# EAGLE design PGTN029_sequential_switch (EAGLE 9.6.0)
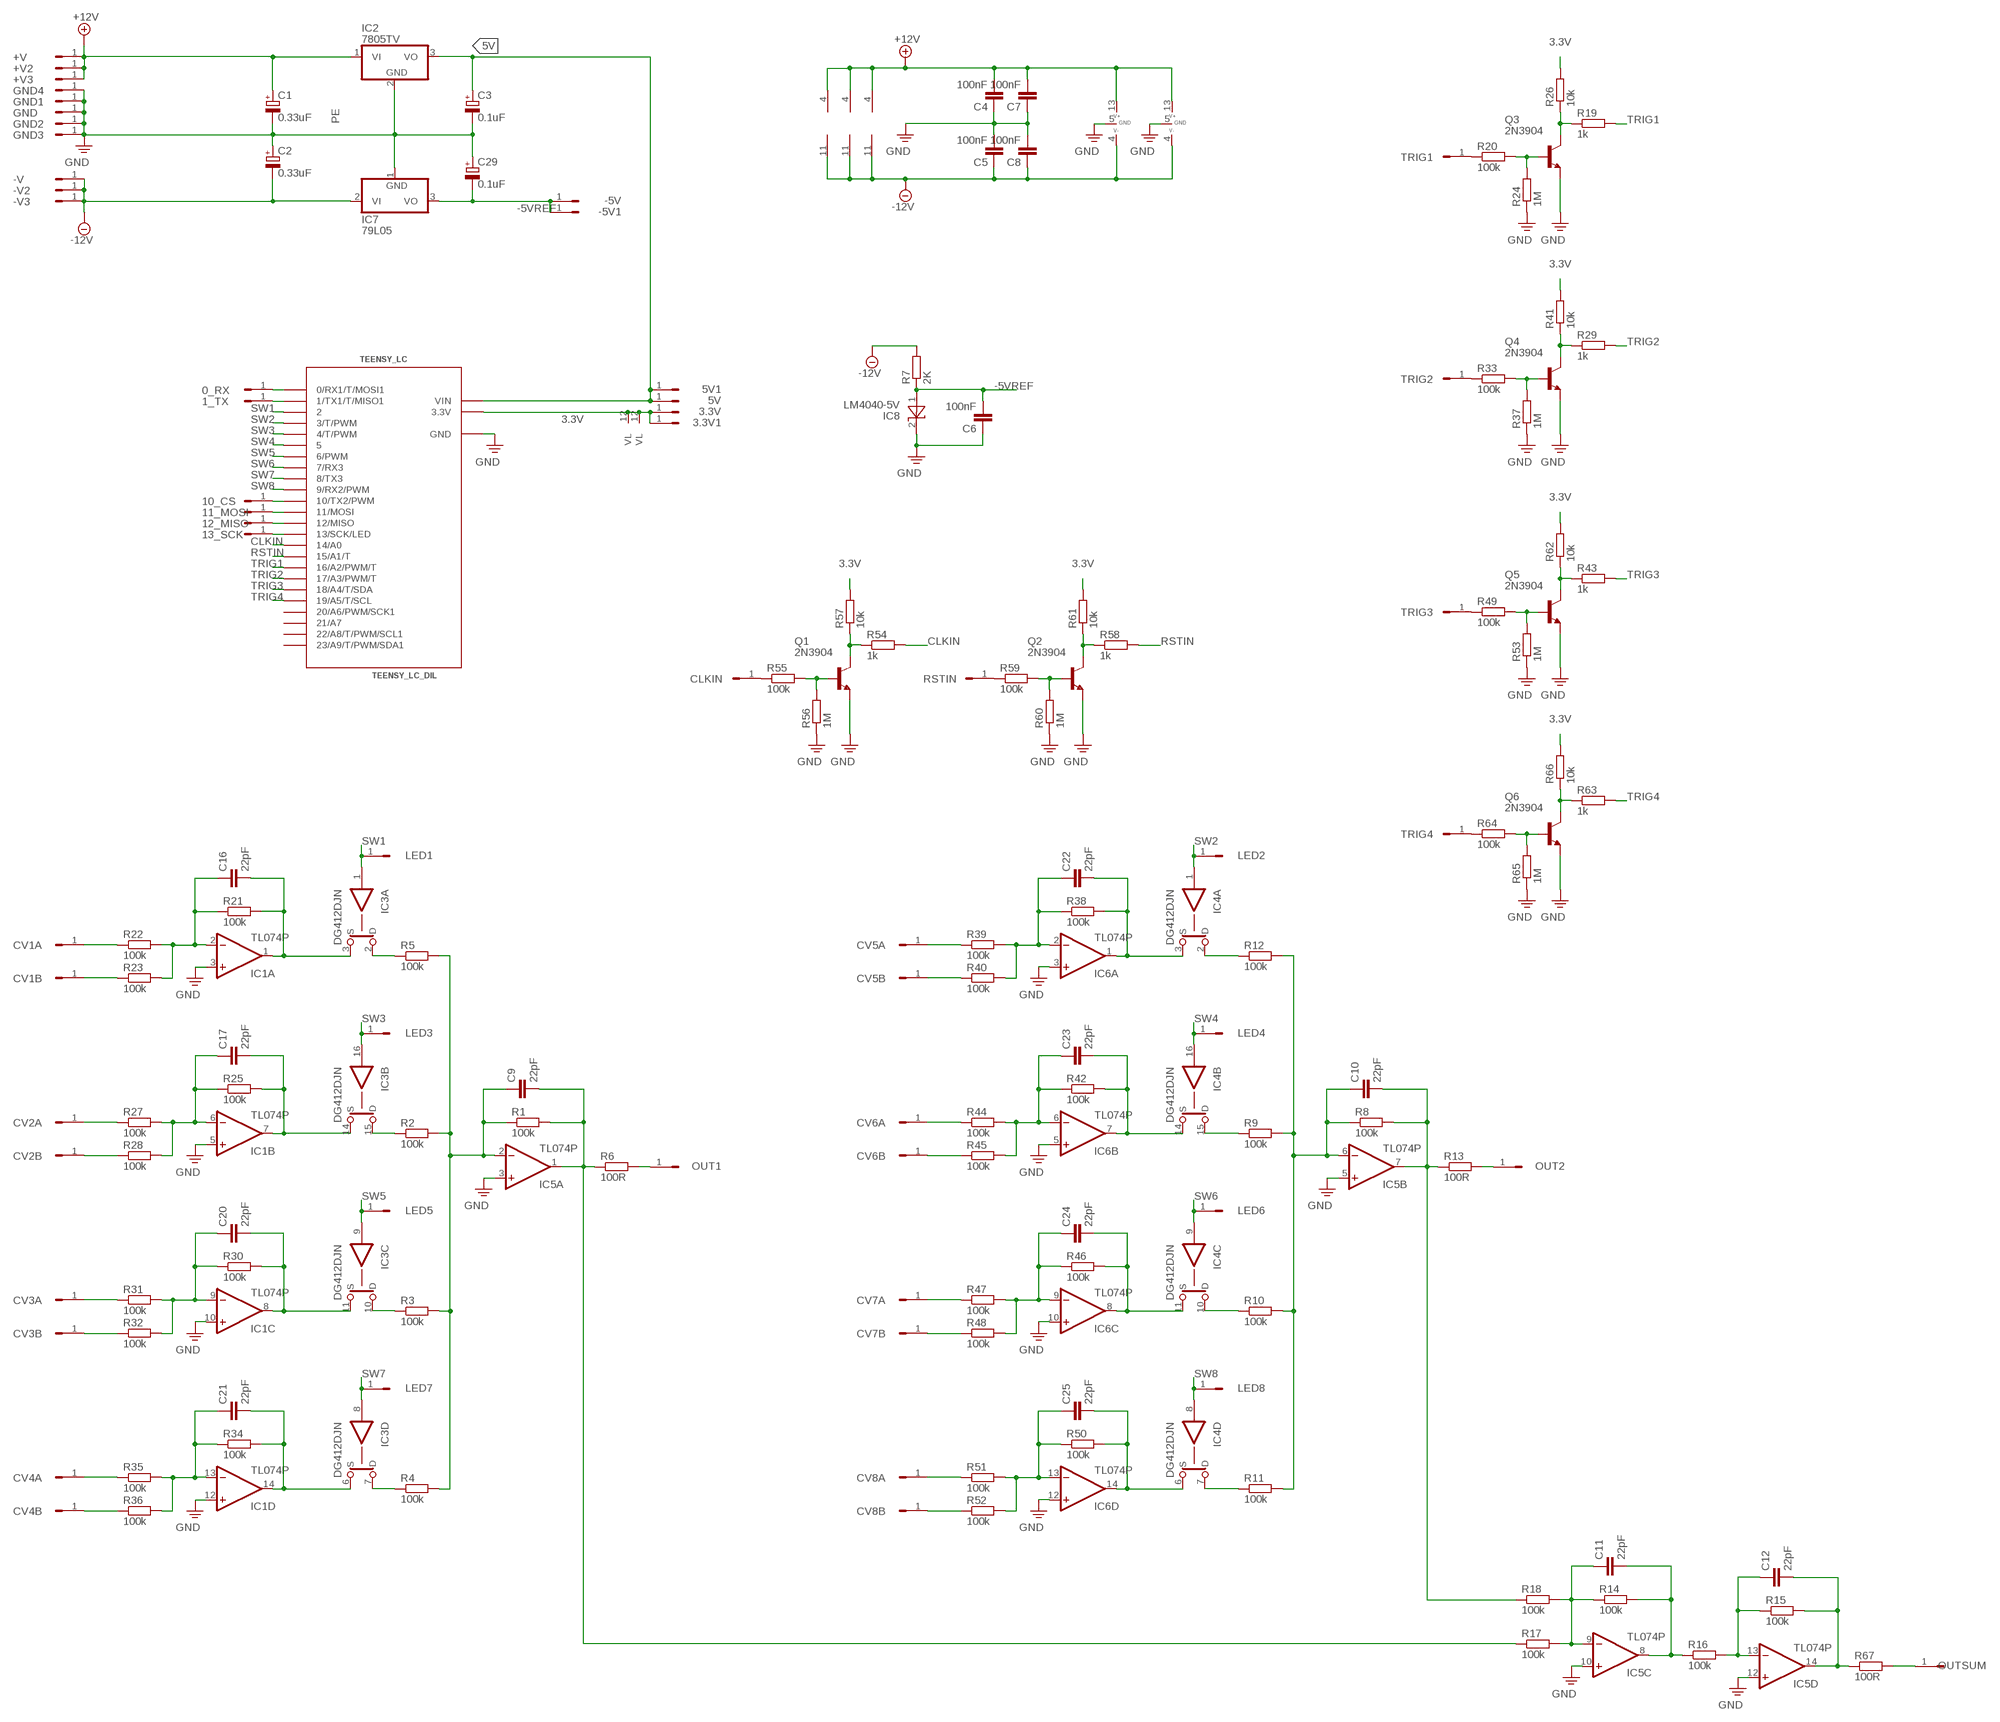
[diagram p0: schematic, sheet 1]

## Parts
0_RX  HEADER/MALE/01  [HEADER/MALE/01]
1_TX  HEADER/MALE/01  [HEADER/MALE/01]
3.3V  HEADER/MALE/01  [HEADER/MALE/01]
3.3V1  HEADER/MALE/01  [HEADER/MALE/01]
5V  HEADER/MALE/01  [HEADER/MALE/01]
5V1  HEADER/MALE/01  [HEADER/MALE/01]
10_CS  HEADER/MALE/01  [HEADER/MALE/01]
11_MOSI  HEADER/MALE/01  [HEADER/MALE/01]
12_MISO  HEADER/MALE/01  [HEADER/MALE/01]
13_SCK  HEADER/MALE/01  [HEADER/MALE/01]
+V  HEADER/MALE/01  [HEADER/MALE/01]
+V2  HEADER/MALE/01  [HEADER/MALE/01]
+V3  HEADER/MALE/01  [HEADER/MALE/01]
-5V  HEADER/MALE/01  [HEADER/MALE/01]
-5V1  HEADER/MALE/01  [HEADER/MALE/01]
-V  HEADER/MALE/01  [HEADER/MALE/01]
-V2  HEADER/MALE/01  [HEADER/MALE/01]
-V3  HEADER/MALE/01  [HEADER/MALE/01]
C1  0.33uF  CAPACITOR/POLARIZEDE2.5-6  [E2,5-6]
C2  0.33uF  CAPACITOR/POLARIZEDE2.5-6  [E2,5-6]
C3  0.1uF  CAPACITOR/POLARIZEDE2.5-6  [E2,5-6]
C4  100nF  CAPACITORCERAMICDISC/5  [CERAMICDISC/5]
C5  100nF  CAPACITORCERAMICDISC/5  [CERAMICDISC/5]
C6  100nF  CAPACITORCERAMICDISC/5  [CERAMICDISC/5]
C7  100nF  CAPACITORCERAMICDISC/5  [CERAMICDISC/5]
C8  100nF  CAPACITORCERAMICDISC/5  [CERAMICDISC/5]
C9  22pF  CAPACITORCERAMICDISC/5  [CERAMICDISC/5]
C10  22pF  CAPACITORCERAMICDISC/5  [CERAMICDISC/5]
C11  22pF  CAPACITORCERAMICDISC/5  [CERAMICDISC/5]
C12  22pF  CAPACITORCERAMICDISC/5  [CERAMICDISC/5]
C16  22pF  CAPACITORCERAMICDISC/5  [CERAMICDISC/5]
C17  22pF  CAPACITORCERAMICDISC/5  [CERAMICDISC/5]
C20  22pF  CAPACITORCERAMICDISC/5  [CERAMICDISC/5]
C21  22pF  CAPACITORCERAMICDISC/5  [CERAMICDISC/5]
C22  22pF  CAPACITORCERAMICDISC/5  [CERAMICDISC/5]
C23  22pF  CAPACITORCERAMICDISC/5  [CERAMICDISC/5]
C24  22pF  CAPACITORCERAMICDISC/5  [CERAMICDISC/5]
C25  22pF  CAPACITORCERAMICDISC/5  [CERAMICDISC/5]
C29  0.1uF  CAPACITOR/POLARIZEDE2.5-6  [E2,5-6]
CLKIN  HEADER/MALE/01  [HEADER/MALE/01]
CV1A  HEADER/MALE/01  [HEADER/MALE/01]
CV1B  HEADER/MALE/01  [HEADER/MALE/01]
CV2A  HEADER/MALE/01  [HEADER/MALE/01]
CV2B  HEADER/MALE/01  [HEADER/MALE/01]
CV3A  HEADER/MALE/01  [HEADER/MALE/01]
CV3B  HEADER/MALE/01  [HEADER/MALE/01]
CV4A  HEADER/MALE/01  [HEADER/MALE/01]
CV4B  HEADER/MALE/01  [HEADER/MALE/01]
CV5A  HEADER/MALE/01  [HEADER/MALE/01]
CV5B  HEADER/MALE/01  [HEADER/MALE/01]
CV6A  HEADER/MALE/01  [HEADER/MALE/01]
CV6B  HEADER/MALE/01  [HEADER/MALE/01]
CV7A  HEADER/MALE/01  [HEADER/MALE/01]
CV7B  HEADER/MALE/01  [HEADER/MALE/01]
CV8A  HEADER/MALE/01  [HEADER/MALE/01]
CV8B  HEADER/MALE/01  [HEADER/MALE/01]
GND  HEADER/MALE/01  [HEADER/MALE/01]
GND1  HEADER/MALE/01  [HEADER/MALE/01]
GND2  HEADER/MALE/01  [HEADER/MALE/01]
GND3  HEADER/MALE/01  [HEADER/MALE/01]
GND4  HEADER/MALE/01  [HEADER/MALE/01]
IC1  TL074P  [DIL14]
IC2  7805TV  [TO220V]
IC3  DG412DJN  [DIL16]
IC4  DG412DJN  [DIL16]
IC5  TL074P  [DIL14]
IC6  TL074P  [DIL14]
IC7  79L05  79L05Z  [TO92]
IC8  LM4040-5V  LM4040  [TO92]
LED1  HEADER/MALE/01  [HEADER/MALE/01]
LED2  HEADER/MALE/01  [HEADER/MALE/01]
LED3  HEADER/MALE/01  [HEADER/MALE/01]
LED4  HEADER/MALE/01  [HEADER/MALE/01]
LED5  HEADER/MALE/01  [HEADER/MALE/01]
LED6  HEADER/MALE/01  [HEADER/MALE/01]
LED7  HEADER/MALE/01  [HEADER/MALE/01]
LED8  HEADER/MALE/01  [HEADER/MALE/01]
OUT1  HEADER/MALE/01  [HEADER/MALE/01]
OUT2  HEADER/MALE/01  [HEADER/MALE/01]
OUTSUM  HEADER/MALE/01  [HEADER/MALE/01]
Q1  2N3904  [TO92]
Q2  2N3904  [TO92]
Q3  2N3904  [TO92]
Q4  2N3904  [TO92]
Q5  2N3904  [TO92]
Q6  2N3904  [TO92]
R1  100k  RESISTORRESISTOR/UPRIGHT/7.5  [RESISTOR/7.5]
R2  100k  RESISTORRESISTOR/UPRIGHT/7.5  [RESISTOR/7.5]
R3  100k  RESISTORRESISTOR/UPRIGHT/7.5  [RESISTOR/7.5]
R4  100k  RESISTORRESISTOR/UPRIGHT/7.5  [RESISTOR/7.5]
R5  100k  RESISTORRESISTOR/UPRIGHT/7.5  [RESISTOR/7.5]
R6  100R  RESISTORRESISTOR/UPRIGHT/7.5  [RESISTOR/7.5]
R7  2K  RESISTORRESISTOR/UPRIGHT/7.5  [RESISTOR/7.5]
R8  100k  RESISTORRESISTOR/UPRIGHT/7.5  [RESISTOR/7.5]
R9  100k  RESISTORRESISTOR/UPRIGHT/7.5  [RESISTOR/7.5]
R10  100k  RESISTORRESISTOR/UPRIGHT/7.5  [RESISTOR/7.5]
R11  100k  RESISTORRESISTOR/UPRIGHT/7.5  [RESISTOR/7.5]
R12  100k  RESISTORRESISTOR/UPRIGHT/7.5  [RESISTOR/7.5]
R13  100R  RESISTORRESISTOR/UPRIGHT/7.5  [RESISTOR/7.5]
R14  100k  RESISTORRESISTOR/UPRIGHT/7.5  [RESISTOR/7.5]
R15  100k  RESISTORRESISTOR/UPRIGHT/7.5  [RESISTOR/7.5]
R16  100k  RESISTORRESISTOR/UPRIGHT/7.5  [RESISTOR/7.5]
R17  100k  RESISTORRESISTOR/UPRIGHT/7.5  [RESISTOR/7.5]
R18  100k  RESISTORRESISTOR/UPRIGHT/7.5  [RESISTOR/7.5]
R19  1k  RESISTORRESISTOR/UPRIGHT/7.5  [RESISTOR/7.5]
R20  100k  RESISTORRESISTOR/UPRIGHT/7.5  [RESISTOR/7.5]
R21  100k  RESISTORRESISTOR/UPRIGHT/7.5  [RESISTOR/7.5]
R22  100k  RESISTORRESISTOR/UPRIGHT/7.5  [RESISTOR/7.5]
R23  100k  RESISTORRESISTOR/UPRIGHT/7.5  [RESISTOR/7.5]
R24  1M  RESISTORRESISTOR/UPRIGHT/7.5  [RESISTOR/7.5]
R25  100k  RESISTORRESISTOR/UPRIGHT/7.5  [RESISTOR/7.5]
R26  10k  RESISTORRESISTOR/UPRIGHT/7.5  [RESISTOR/7.5]
R27  100k  RESISTORRESISTOR/UPRIGHT/7.5  [RESISTOR/7.5]
R28  100k  RESISTORRESISTOR/UPRIGHT/7.5  [RESISTOR/7.5]
R29  1k  RESISTORRESISTOR/UPRIGHT/7.5  [RESISTOR/7.5]
R30  100k  RESISTORRESISTOR/UPRIGHT/7.5  [RESISTOR/7.5]
R31  100k  RESISTORRESISTOR/UPRIGHT/7.5  [RESISTOR/7.5]
R32  100k  RESISTORRESISTOR/UPRIGHT/7.5  [RESISTOR/7.5]
R33  100k  RESISTORRESISTOR/UPRIGHT/7.5  [RESISTOR/7.5]
R34  100k  RESISTORRESISTOR/UPRIGHT/7.5  [RESISTOR/7.5]
R35  100k  RESISTORRESISTOR/UPRIGHT/7.5  [RESISTOR/7.5]
R36  100k  RESISTORRESISTOR/UPRIGHT/7.5  [RESISTOR/7.5]
R37  1M  RESISTORRESISTOR/UPRIGHT/7.5  [RESISTOR/7.5]
R38  100k  RESISTORRESISTOR/UPRIGHT/7.5  [RESISTOR/7.5]
R39  100k  RESISTORRESISTOR/UPRIGHT/7.5  [RESISTOR/7.5]
R40  100k  RESISTORRESISTOR/UPRIGHT/7.5  [RESISTOR/7.5]
R41  10k  RESISTORRESISTOR/UPRIGHT/7.5  [RESISTOR/7.5]
R42  100k  RESISTORRESISTOR/UPRIGHT/7.5  [RESISTOR/7.5]
R43  1k  RESISTORRESISTOR/UPRIGHT/7.5  [RESISTOR/7.5]
R44  100k  RESISTORRESISTOR/UPRIGHT/7.5  [RESISTOR/7.5]
R45  100k  RESISTORRESISTOR/UPRIGHT/7.5  [RESISTOR/7.5]
R46  100k  RESISTORRESISTOR/UPRIGHT/7.5  [RESISTOR/7.5]
R47  100k  RESISTORRESISTOR/UPRIGHT/7.5  [RESISTOR/7.5]
R48  100k  RESISTORRESISTOR/UPRIGHT/7.5  [RESISTOR/7.5]
R49  100k  RESISTORRESISTOR/UPRIGHT/7.5  [RESISTOR/7.5]
R50  100k  RESISTORRESISTOR/UPRIGHT/7.5  [RESISTOR/7.5]
R51  100k  RESISTORRESISTOR/UPRIGHT/7.5  [RESISTOR/7.5]
R52  100k  RESISTORRESISTOR/UPRIGHT/7.5  [RESISTOR/7.5]
R53  1M  RESISTORRESISTOR/UPRIGHT/7.5  [RESISTOR/7.5]
R54  1k  RESISTORRESISTOR/UPRIGHT/7.5  [RESISTOR/7.5]
R55  100k  RESISTORRESISTOR/UPRIGHT/7.5  [RESISTOR/7.5]
R56  1M  RESISTORRESISTOR/UPRIGHT/7.5  [RESISTOR/7.5]
R57  10k  RESISTORRESISTOR/UPRIGHT/7.5  [RESISTOR/7.5]
R58  1k  RESISTORRESISTOR/UPRIGHT/7.5  [RESISTOR/7.5]
R59  100k  RESISTORRESISTOR/UPRIGHT/7.5  [RESISTOR/7.5]
R60  1M  RESISTORRESISTOR/UPRIGHT/7.5  [RESISTOR/7.5]
R61  10k  RESISTORRESISTOR/UPRIGHT/7.5  [RESISTOR/7.5]
R62  10k  RESISTORRESISTOR/UPRIGHT/7.5  [RESISTOR/7.5]
R63  1k  RESISTORRESISTOR/UPRIGHT/7.5  [RESISTOR/7.5]
R64  100k  RESISTORRESISTOR/UPRIGHT/7.5  [RESISTOR/7.5]
R65  1M  RESISTORRESISTOR/UPRIGHT/7.5  [RESISTOR/7.5]
R66  10k  RESISTORRESISTOR/UPRIGHT/7.5  [RESISTOR/7.5]
R67  100R  RESISTORRESISTOR/UPRIGHT/7.5  [RESISTOR/7.5]
RSTIN  HEADER/MALE/01  [HEADER/MALE/01]
TEENSY_LC  TEENSY_LC_DIL  [TEENSY_3.0-3.2&LC_DIL]
TRIG1  HEADER/MALE/01  [HEADER/MALE/01]
TRIG2  HEADER/MALE/01  [HEADER/MALE/01]
TRIG3  HEADER/MALE/01  [HEADER/MALE/01]
TRIG4  HEADER/MALE/01  [HEADER/MALE/01]

## Nets
3.3V: 3.3V1.1 3.3V.1 IC3.12(VL:VL) IC4.12(VL:VL) R26.2 R41.2 R57.2 R61.2 R62.2 R66.2 TEENSY_LC.3.3V
5V: 5V1.1 5V.1 C3.+ IC2.3(VO) TEENSY_LC.VIN
+12V: +V2.1 +V3.1 +V.1 C1.+ C4.2 C7.2 IC1.4(P:V+) IC2.1(VI) IC3.13(P:V+) IC4.13(P:V+) IC5.4(P:V+) IC6.4(P:V+)
-5VREF: -5V1.1 -5V.1 C6.2 C29.- IC7.3(VO) IC8.1(A) R7.1
-12V: -V2.1 -V3.1 -V.1 C2.- C5.1 C8.1 IC1.11(P:V-) IC3.4(P:V-) IC4.4(P:V-) IC5.11(P:V-) IC6.11(P:V-) IC7.2(VI) R7.2
ADC0: C16.2 IC1.1(A:OUT) IC3.3(A:S) R21.2
ADC1: C17.2 IC1.7(B:OUT) IC3.14(B:S) R25.2
ADC2: C20.2 IC1.8(C:OUT) IC3.11(C:S) R30.2
ADC3: C21.2 IC1.14(D:OUT) IC3.6(D:S) R34.2
ADC4: C22.2 IC4.3(A:S) IC6.1(A:OUT) R38.2
ADC5: C23.2 IC4.14(B:S) IC6.7(B:OUT) R42.2
ADC6: C24.2 IC4.11(C:S) IC6.8(C:OUT) R46.2
ADC7: C25.2 IC4.6(D:S) IC6.14(D:OUT) R50.2
CLKIN: R54.2 TEENSY_LC.14/A0
N$1: CV2A.1 R27.1
N$2: C9.1 IC5.2(A:-IN) R1.1 R2.2 R3.2 R4.2 R5.2
N$3: C9.2 IC5.1(A:OUT) R1.2 R6.1 R17.1
N$4: IC3.15(B:D) R2.1
N$5: IC3.2(A:D) R5.1
N$6: IC3.10(C:D) R3.1
N$7: IC3.7(D:D) R4.1
N$8: C10.1 IC5.6(B:-IN) R8.1 R9.2 R10.2 R11.2 R12.2
N$9: C10.2 IC5.7(B:OUT) R8.2 R13.1 R18.1
N$10: IC4.15(B:D) R9.1
N$11: IC4.2(A:D) R12.1
N$12: IC4.10(C:D) R10.1
N$13: IC4.7(D:D) R11.1
N$14: OUT1.1 R6.2
N$15: OUT2.1 R13.2
N$16: C11.2 IC5.8(C:OUT) R14.2 R16.1
N$17: C11.1 IC5.9(C:-IN) R14.1 R17.2 R18.2
N$18: C12.2 IC5.14(D:OUT) R15.2 R67.1
N$19: C12.1 IC5.13(D:-IN) R15.1 R16.2
N$20: R20.1 TRIG1.1
N$21: Q3.2(B) R20.2 R24.2
N$22: CV1A.1 R22.1
N$23: Q3.1(C) R19.1 R26.1
N$24: C16.1 IC1.2(A:-IN) R21.1 R22.2 R23.2
N$25: R59.1 RSTIN.1
N$26: CV2B.1 R28.1
N$27: CV1B.1 R23.1
N$28: OUTSUM.1 R67.2
N$29: C17.1 IC1.6(B:-IN) R25.1 R27.2 R28.2
N$30: C21.1 IC1.13(D:-IN) R34.1 R35.2 R36.2
N$31: CV4A.1 R35.1
N$32: CV4B.1 R36.1
N$33: R33.1 TRIG2.1
N$34: CV3B.1 R32.1
N$35: CV3A.1 R31.1
N$36: C20.1 IC1.9(C:-IN) R30.1 R31.2 R32.2
N$37: 12_MISO.1 TEENSY_LC.12(12/MISO)
N$38: C22.1 IC6.2(A:-IN) R38.1 R39.2 R40.2
N$39: 0_RX.1 TEENSY_LC.0(0/RX1/T/MOSI1)
N$40: CV5B.1 R40.1
N$41: CV5A.1 R39.1
N$42: 1_TX.1 TEENSY_LC.1(1/TX1/T/MISO1)
N$43: C23.1 IC6.6(B:-IN) R42.1 R44.2 R45.2
N$44: CV6A.1 R44.1
N$45: CV6B.1 R45.1
N$46: C25.1 IC6.13(D:-IN) R50.1 R51.2 R52.2
N$47: Q4.2(B) R33.2 R37.2
N$48: CV8A.1 R51.1
N$49: CV8B.1 R52.1
N$50: CV7B.1 R48.1
N$51: CV7A.1 R47.1
N$52: C24.1 IC6.9(C:-IN) R46.1 R47.2 R48.2
N$53: Q4.1(C) R29.1 R41.1
N$54: CLKIN.1 R55.1
N$55: Q1.2(B) R55.2 R56.2
N$56: Q1.1(C) R54.1 R57.1
N$58: Q2.2(B) R59.2 R60.2
N$59: Q2.1(C) R58.1 R61.1
N$60: R49.1 TRIG3.1
N$61: Q5.2(B) R49.2 R53.2
N$62: 10_CS.1 TEENSY_LC.10(10/TX2/PWM)
N$63: 11_MOSI.1 TEENSY_LC.11(11/MOSI)
N$64: 13_SCK.1 TEENSY_LC.13(13/SCK/LED)
N$65: Q5.1(C) R43.1 R62.1
N$67: R64.1 TRIG4.1
N$68: Q6.2(B) R64.2 R65.2
N$69: Q6.1(C) R63.1 R66.1
PE: C1.- C2.+ C3.- C4.1 C5.2 C6.1 C7.1 C8.2 C29.+ GND1.1 GND2.1 GND3.1 GND4.1 GND.1 IC1.3(A:+IN) IC1.5(B:+IN) IC1.10(C:+IN) IC1.12(D:+IN) IC2.2(GND) IC3.5(P:GND) IC4.5(P:GND) IC5.3(A:+IN) IC5.5(B:+IN) IC5.10(C:+IN) IC5.12(D:+IN) IC6.3(A:+IN) IC6.5(B:+IN) IC6.10(C:+IN) IC6.12(D:+IN) IC7.1(GND) IC8.2(C) Q1.3(E) Q2.3(E) Q3.3(E) Q4.3(E) Q5.3(E) Q6.3(E) R24.1 R37.1 R53.1 R56.1 R60.1 R65.1 TEENSY_LC.AGND(GND) TEENSY_LC.GND ; supply symbol labelled GND
RSTIN: R58.2 TEENSY_LC.15/A1(15/A1/T)
SW1: IC3.1(A:IN) LED1.1 TEENSY_LC.2
SW2: IC4.1(A:IN) LED2.1 TEENSY_LC.3(3/T/PWM)
SW3: IC3.16(B:IN) LED3.1 TEENSY_LC.4(4/T/PWM)
SW4: IC4.16(B:IN) LED4.1 TEENSY_LC.5
SW5: IC3.9(C:IN) LED5.1 TEENSY_LC.6(6/PWM)
SW6: IC4.9(C:IN) LED6.1 TEENSY_LC.7(7/RX3)
SW7: IC3.8(D:IN) LED7.1 TEENSY_LC.8(8/TX3)
SW8: IC4.8(D:IN) LED8.1 TEENSY_LC.9(9/RX2/PWM)
TRIG1: R19.2 TEENSY_LC.16/A2(16/A2/PWM/T)
TRIG2: R29.2 TEENSY_LC.17/A3(17/A3/PWM/T)
TRIG3: R43.2 TEENSY_LC.18/A4(18/A4/T/SDA)
TRIG4: R63.2 TEENSY_LC.19/A5(19/A5/T/SCL)
Unconnected: TEENSY_LC.20/A6(20/A6/PWM/SCK1) TEENSY_LC.21/A7 TEENSY_LC.22/A8(22/A8/T/PWM/SCL1) TEENSY_LC.23/A9(23/A9/T/PWM/SDA1)

## Library data of the parts
0_RX 1_TX 3.3V 3.3V1 5V 5V1 10_CS 11_MOSI 12_MISO 13_SCK +V +V2 +V3 -5V -5V1 -V -V2 -V3 CLKIN CV1A CV1B CV2A CV2B CV3A CV3B CV4A CV4B CV5A CV5B CV6A CV6B CV7A CV7B CV8A CV8B GND GND1-GND4 LED1-LED8 OUT1 OUT2 OUTSUM RSTIN TRIG1-TRIG4 = connectors:HEADER/MALE/01; SPICEPREFIX: X
C1-C3 C29 = capacitors:CAPACITOR/POLARIZED: POLARIZED CAPACITOR, European symbol; SPICEPREFIX: C
C4-C12 C16 C17 C20-C25 = capacitors:CAPACITOR: CAPACITOR, European symbol
IC1 IC5 IC6 = ic_analogue:TL074: OP AMP
IC2 = ic_voltage_reg:78*: Positive VOLTAGE REGULATOR Source: http://cache.national.com/ds/LM/LM78L05.pdf http://www.fairchildsemi.com/ds/LM/LM7805.pdf
IC3 IC4 = ic_digital:DG412DJ: CMOS SWITCH
IC7 = linear:79*: Negative VOLTAGE REGULATOR
IC8 = ic_voltage_reg:LM4040
Q1-Q6 = transistors:2N3904: NPN Transistor
R1-R67 = resistors:RESISTOR: RESISTOR, European symbol
TEENSY_LC = microcontroller:TEENSY_LC_DIL

## Board
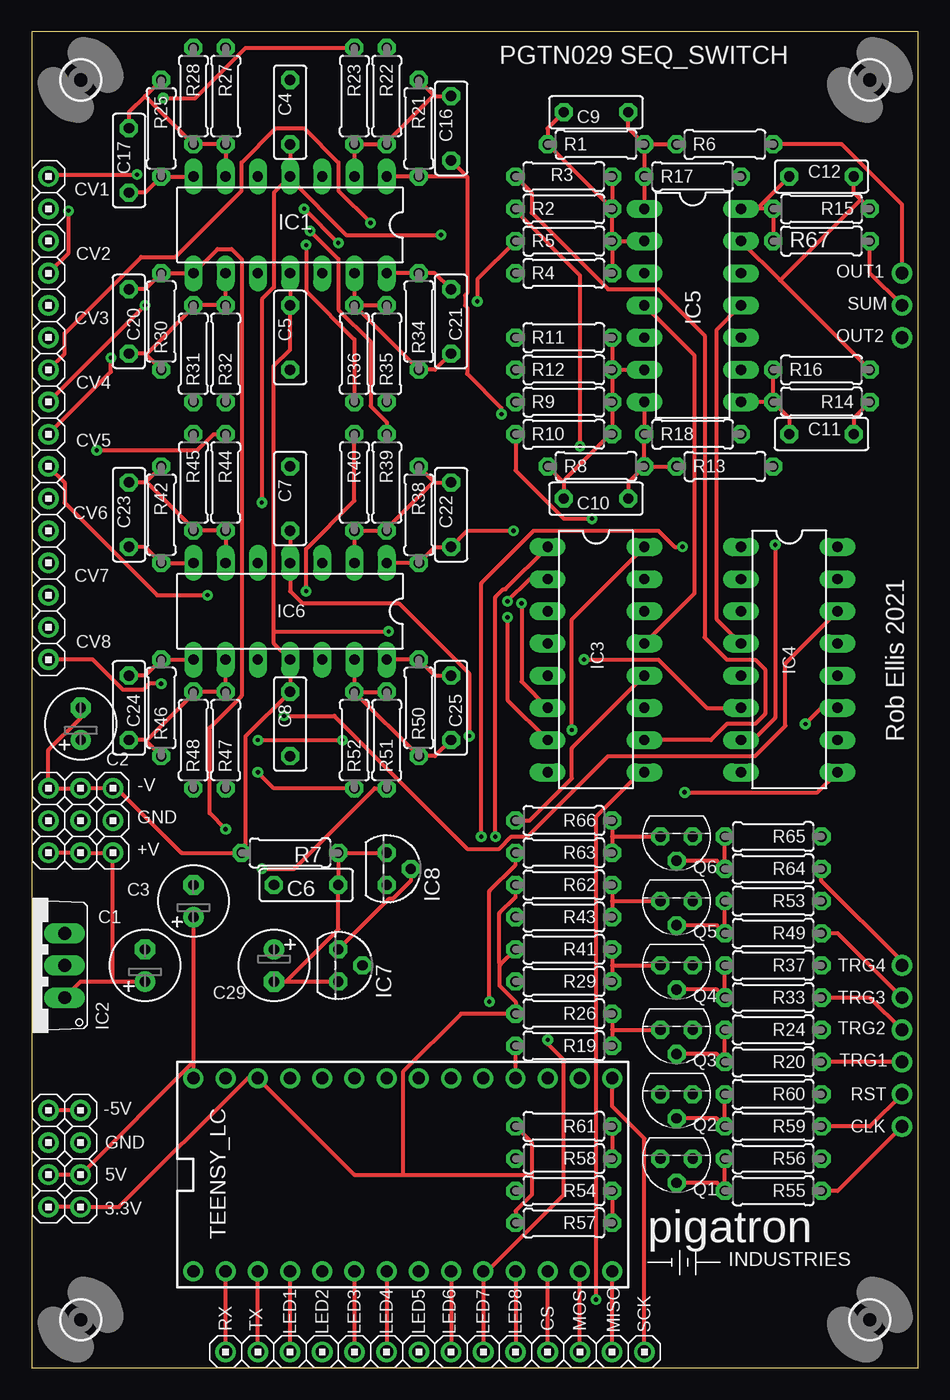
[diagram p1: board, top side]
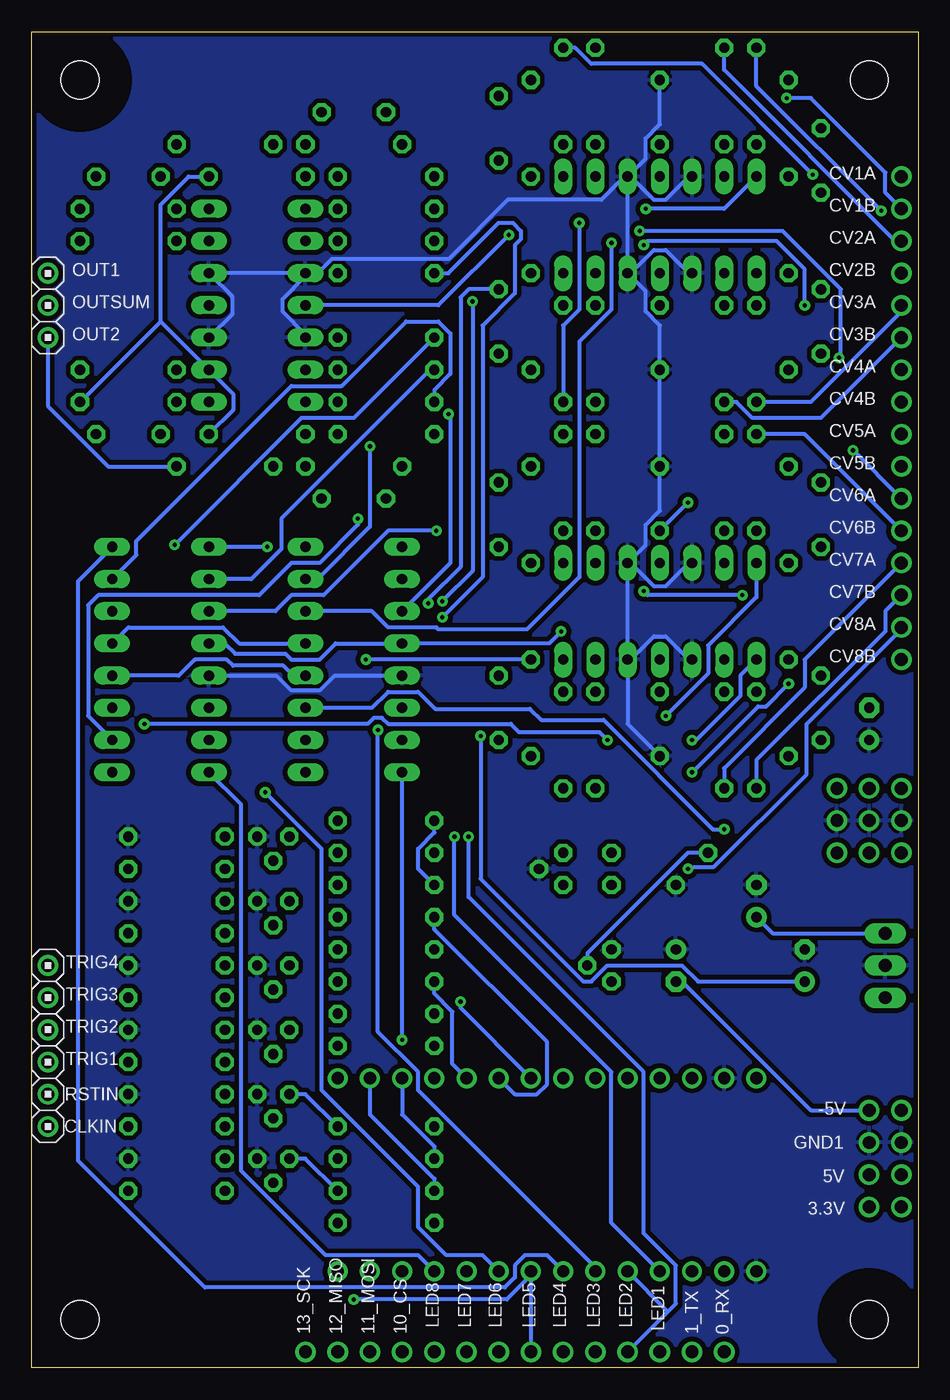
[diagram p2: board, bottom side, seen from below]

Size 69.9 x 105.4 mm. Coordinates in mm from the lower left corner, seen from the top.
Outline: 69.9,105.4 0,105.4 0,0 69.9,0 69.9,105.4
Copper layers (1*16): Top 0.0356mm / dielectric 1.5011mm / Bottom 0.0356mm
Design rules "pigatron": minimum track width 12mil, minimum drill 13mil, track to track 15mil, track to pad 10mil, pad to pad 10mil, via to via 10mil, smd to smd 6mil, copper to edge 15mil, drill to drill 10mil, minimum pad ring 12mil, minimum via ring 10mil, stop-mask expansion 4mil, vias tented up to drill 0mil, thermal gap 10mil

### Footprints (pad centres in the part's own frame; a part is rotated, then mirrored left to right if it is on the bottom)
HEADER/MALE/01 = drill 1.016: 1 0,0
E2,5-6 = drill 0.813 pad 1.6: + -1.27,0 | drill 0.813 pad 1.6 octagon: - 1.27,0
CERAMICDISC/5 = drill 0.813 octagon: 1 -2.54,0; 2 2.54,0
DIL14 = drill 0.813 long: 1 -7.62,-3.81; 2 -5.08,-3.81; 3 -2.54,-3.81; 4 0,-3.81; 5 2.54,-3.81; 6 5.08,-3.81; 7 7.62,-3.81; 8 7.62,3.81; 9 5.08,3.81; 10 2.54,3.81; 11 0,3.81; 12 -2.54,3.81; 13 -5.08,3.81; 14 -7.62,3.81
TO220V = drill 1.016 long: 1 -2.54,-2.54; 2 0,-2.54; 3 2.54,-2.54
DIL16 = drill 0.813 long: 1 -8.89,-3.81; 2 -6.35,-3.81; 3 -3.81,-3.81; 4 -1.27,-3.81; 5 1.27,-3.81; 6 3.81,-3.81; 7 6.35,-3.81; 8 8.89,-3.81; 9 8.89,3.81; 10 6.35,3.81; 11 3.81,3.81; 12 1.27,3.81; 13 -1.27,3.81; 14 -3.81,3.81; 15 -6.35,3.81; 16 -8.89,3.81
TO92 = drill 0.813 octagon: 1 -1.27,0; 2 0,1.905; 3 1.27,0
TO92' = drill 0.813 octagon: 1 1.27,0; 2 0,1.905; 3 -1.27,0
RESISTOR/7.5 = drill 0.813 octagon: 1 -3.81,0; 2 3.81,0
TEENSY_3.0-3.2&LC_DIL = drill 0.965: 0 -7.62,13.97; 1 -7.62,11.43; 2 -7.62,8.89; 3 -7.62,6.35; 3.3V 7.62,11.43; 4 -7.62,3.81; 5 -7.62,1.27; 6 -7.62,-1.27; 7 -7.62,-3.81; 8 -7.62,-6.35; 9 -7.62,-8.89; 10 -7.62,-11.43; 11 -7.62,-13.97; 12 -7.62,-16.51; 13 7.62,-16.51; 14/A0 7.62,-13.97; 15/A1 7.62,-11.43; 16/A2 7.62,-8.89; 17/A3 7.62,-6.35; 18/A4 7.62,-3.81; 19/A5 7.62,-1.27; 20/A6 7.62,1.27; 21/A7 7.62,3.81; 22/A8 7.62,6.35; 23/A9 7.62,8.89; AGND 7.62,13.97; GND -7.62,16.51; VIN 7.62,16.51
STANDOFF/3.0 = hole 3: 0,0

### Placement (x,y rotation side)
0_RX  15.29,1.26 90 top
1_TX  17.83,1.26 90 top
3.3V  1.32,12.69 270 top
3.3V1  3.86,12.69 0 top
5V  1.32,15.23 180 top
5V1  3.86,15.23 0 top
10_CS  40.69,1.26 90 top
11_MOSI  43.23,1.26 90 top
12_MISO  45.77,1.26 90 top
13_SCK  48.31,1.26 90 top
+V  6.4,40.63 0 top
+V2  3.86,40.63 180 top
+V3  1.32,40.63 180 top
-5V  1.32,20.31 0 top
-5V1  3.86,20.31 0 top
-V  6.4,45.71 0 top
-V2  3.86,45.71 180 top
-V3  1.32,45.71 180 top
C1  8.94,31.74 90 top
C2  3.86,50.79 90 top
C3  12.75,36.82 90 top
C4  20.37,99.05 270 top
C5  20.37,81.27 270 top
C6  21.64,38.09 0 top
C7  20.37,68.57 270 top
C8  20.37,50.79 270 top
C9  44.5,99.05 0 top
C10  44.5,68.57 0 top
C11  62.28,73.65 180 top
C12  62.28,93.97 180 top
C16  33.07,97.78 270 top
C17  7.67,95.24 270 top
C20  7.67,82.54 90 top
C21  33.07,82.54 90 top
C22  33.07,67.3 270 top
C23  7.67,67.3 270 top
C24  7.67,52.06 90 top
C25  33.07,52.06 90 top
C29  19.1,31.74 270 top
CLKIN  68.63,19.04 180 bottom
CV1A  1.32,93.97 0 top
CV1B  1.32,91.43 0 top
CV2A  1.32,88.89 0 top
CV2B  1.32,86.35 0 top
CV3A  1.32,83.81 0 top
CV3B  1.32,81.27 0 top
CV4A  1.32,78.73 0 top
CV4B  1.32,76.19 0 top
CV5A  1.32,73.65 0 top
CV5B  1.32,71.11 0 top
CV6A  1.32,68.57 0 top
CV6B  1.32,66.03 0 top
CV7A  1.32,63.49 0 top
CV7B  1.32,60.95 0 top
CV8A  1.32,58.41 0 top
CV8B  1.32,55.87 0 top
GND  6.4,43.17 0 top
GND1  1.32,17.77 0 top
GND2  1.32,43.17 180 top
GND3  3.86,43.17 180 top
GND4  3.86,17.77 0 top
IC1  20.37,90.16 180 top
IC2  0.05,31.74 90 top
IC3  44.5,55.87 270 top
IC4  59.74,55.87 270 top
IC5  52.12,83.81 270 top
IC6  20.37,59.68 180 top
IC7  24.18,31.74 270 top
IC8  27.99,39.36 270 top
LED1  20.37,1.26 90 top
LED2  22.91,1.26 90 top
LED3  25.45,1.26 90 top
LED4  27.99,1.26 90 top
LED5  30.53,1.26 90 top
LED6  33.07,1.26 90 top
LED7  35.61,1.26 90 top
LED8  38.15,1.26 90 top
OUT1  68.63,86.35 0 bottom
OUT2  68.63,81.27 0 bottom
OUTSUM  68.63,83.81 0 bottom
Q1  2N3904  [TO92']  50.85,16.5 180 top
Q2  2N3904  [TO92']  50.85,21.58 180 top
Q3  2N3904  [TO92']  50.85,26.66 180 top
Q4  2N3904  [TO92']  50.85,31.74 180 top
Q5  2N3904  [TO92']  50.85,36.82 180 top
Q6  2N3904  [TO92']  50.85,41.9 180 top
R1  44.5,96.51 0 top
R2  41.96,91.43 0 top
R3  41.96,93.97 0 top
R4  41.96,86.35 0 top
R5  41.96,88.89 0 top
R6  54.66,96.51 0 top
R7  20.37,40.63 180 top
R8  44.5,71.11 0 top
R9  41.96,76.19 0 top
R10  41.96,73.65 0 top
R11  41.96,81.27 0 top
R12  41.96,78.73 0 top
R13  54.66,71.11 0 top
R14  62.28,76.19 180 top
R15  62.28,91.43 180 top
R16  62.28,78.73 0 top
R17  52.12,93.97 0 top
R18  52.12,73.65 0 top
R19  41.96,25.39 180 top
R20  58.47,24.12 180 top
R21  30.53,97.78 270 top
R22  27.99,100.32 270 top
R23  25.45,100.32 270 top
R24  58.47,26.66 180 top
R25  10.21,97.78 270 top
R26  41.96,27.93 180 top
R27  15.29,100.32 270 top
R28  12.75,100.32 270 top
R29  41.96,30.47 180 top
R30  10.21,82.54 90 top
R31  12.75,80 90 top
R32  15.29,80 90 top
R33  58.47,29.2 180 top
R34  30.53,82.54 90 top
R35  27.99,80 90 top
R36  25.45,80 90 top
R37  58.47,31.74 180 top
R38  30.53,67.3 270 top
R39  27.99,69.84 270 top
R40  25.45,69.84 270 top
R41  41.96,33.01 180 top
R42  10.21,67.3 270 top
R43  41.96,35.55 180 top
R44  15.29,69.84 270 top
R45  12.75,69.84 270 top
R46  10.21,52.06 90 top
R47  15.29,49.52 90 top
R48  12.75,49.52 90 top
R49  58.47,34.28 180 top
R50  30.53,52.06 90 top
R51  27.99,49.52 90 top
R52  25.45,49.52 90 top
R53  58.47,36.82 180 top
R54  41.96,13.96 180 top
R55  58.47,13.96 180 top
R56  58.47,16.5 180 top
R57  41.96,11.42 180 top
R58  41.96,16.5 180 top
R59  58.47,19.04 180 top
R60  58.47,21.58 180 top
R61  41.96,19.04 180 top
R62  41.96,38.09 180 top
R63  41.96,40.63 180 top
R64  58.47,39.36 180 top
R65  58.47,41.9 180 top
R66  41.96,43.17 180 top
R67  62.28,88.89 0 top
RSTIN  68.63,21.58 180 bottom
TEENSY_LC  29.26,15.23 90 top
TRIG1  68.63,24.12 0 bottom
TRIG2  68.63,26.66 0 bottom
TRIG3  68.63,29.2 0 bottom
TRIG4  68.63,31.74 0 bottom
U$2  [STANDOFF/3.0]  66.09,3.8 180 top
U$3  [STANDOFF/3.0]  3.86,3.8 180 top
U$4  [STANDOFF/3.0]  3.86,101.59 0 top
U$5  [PIGATRON-LOGO]  57.46,9.9 0 top
U$7  [STANDOFF/3.0]  66.09,101.59 0 top

### Tracks (layer width: path | path; a pad name or v marks a point on that pad's centre or on a via)
3.3V
  Top 0.305: R57.2 38.15,12.37 39.42,13.64 39.42,15.23 | 39.42,15.23 39.42,17.77 R61.2 | 3.3V.1 3.3V1.1 6.88,12.69 17.04,22.85 TEENSY_LC.3.3V 25.45,15.23 29.26,15.23 | 29.26,15.23 39.42,15.23 | R41.2 36.96,31.82 | 36.96,31.82 36.88,31.74 36.88,30.15 38.15,28.88 R26.2 33.87,27.93 29.26,23.33 29.26,15.23 | R62.2 38.15,37.14 36.88,35.87 36.88,31.9 36.96,31.82 | IC3.12 42.6,48.89 42.6,46.5 39.26,43.17 R66.2
  Bottom 0.305: R66.2 38.15,42.22 39.42,40.95 39.42,39.36 R62.2 | IC4.12 58.31,54.6 57.04,55.87 54.5,55.87 54.03,55.39 50.06,55.39 49.26,54.6 IC3.12
5V
  Top 0.305: 5V.1 5V1.1 12.75,24.12 | C3.+ 12.75,24.12 | 12.75,24.12 TEENSY_LC.VIN
  Bottom 0.305: IC2.3 11.48,34.28 C3.+
+12V  (via drill 0.33)
  Top 0.305: IC5.4 52.28,79.84 52.28,61.11 IC3.13 | +V3.1 +V2.1 +V.1 6.4,30.47 | 6.4,30.47 3.86,30.47 IC2.1 | 6.4,30.47 C1.+ | C7.2 IC6.4 20.37,61.27 21.32,60.32 28.94,60.32 34.5,54.76 v34.5,49.84 | C4.2 IC1.4 | v18.15,68.25 18.15,84.29 19.1,85.24 19.1,92.7 IC1.4 | v32.28,89.37 24.82,89.37 20.37,93.81 IC1.4
  Bottom 0.305: IC3.13 53.55,57.14 54.82,58.41 62.28,58.41 IC4.13 | v18.15,68.25 C7.2 | C1.+ 17.35,30.47 18.62,31.74 24.5,31.74 25.77,30.47 26.4,30.47 34.5,38.57 v34.5,49.84 | IC5.4 37.83,83.81 v32.28,89.37
-5VREF
  Top 0.305: IC8.1 R7.1 C6.2 24.18,34.6 20.05,30.47 | -5V1.1 -5V.1 | C29.- 20.05,30.47 | 20.05,30.47 IC7.3
  Bottom 0.305: -5V1.1 8.46,20.31 18.62,30.47 C29.-
-12V  (via drill 0.33)
  Top 0.305: IC5.11 54.03,81.91 54.03,59.05 IC4.4 | C2.- 3.86,51.27 1.32,48.73 -V3.1 -V2.1 -V.1 6.72,45.71 11.8,40.63 R7.2 16.88,40.95 16.88,49.84 C8.1 IC6.11 19.1,57.14 19.1,58.09 | IC1.11 C5.1 20.37,80.32 19.1,79.05 19.1,58.09 | 19.1,58.09 v28.15,58.09
  Bottom 0.305: IC4.4 54.66,57.14 53.87,56.35 49.9,56.35 49.42,55.87 47.2,55.87 45.93,57.14 IC3.4 29.1,57.14 v28.15,58.09 | IC7.2 26.09,32.69 18.15,40.63 R7.2
ADC0  (via drill 0.33)
  Top 0.305: IC1.1 R21.2 34.18,93.97 34.26,94.05 | v37.04,75.24 37.04,75.71 34.34,78.41 34.34,83.65 34.18,83.81 34.18,84.6 34.34,84.76 34.34,93.97 34.26,94.05 | C16.2 34.26,94.05
  Bottom 0.305: IC3.3 36.88,63.49 36.88,75.08 v37.04,75.24
ADC1  (via drill 0.33)
  Top 0.305: C17.2 8.94,92.7 R25.2 IC1.7 | v21.48,91.43 v24.18,88.73
  Bottom 0.305: IC3.14 43.07,59.68 41.8,58.41 37.99,58.41 37.83,58.25 30.85,58.25 26.72,62.38 26.72,80.95 24.18,83.49 v24.18,88.73 | v21.48,91.43 15.29,91.43 IC1.7
ADC2  (via drill 0.35)
  Top 0.305: C20.2 8.94,85.08 R30.2 IC1.8 14.66,88.25 15.77,88.25 16.56,87.46 16.56,53.01 14.02,50.47 14.02,43.75 v15.29,42.48
  Bottom 0.305: IC3.11 43.07,52.06 41.8,53.33 39.42,53.33 38.07,51.98 30.61,51.98 29.74,51.11 24.81,51.11 16.19,42.48 v15.29,42.48
ADC3  (via drill 0.33)
  Top 0.305: IC1.14 R34.2 31.8,86.35 C21.2 | IC3.6 38.63,54.12 v38.63,60.32
  Bottom 0.305: v38.63,60.32 38.63,60.63 36.09,63.17 36.09,84.44 35.45,85.08 C21.2
ADC4  (via drill 0.33)
  Top 0.305: IC6.1 R38.2 31.8,64.76 C22.2 34.34,66.03 v37.99,66.03
  Bottom 0.305: IC4.3 50.69,59.68 49.42,60.95 46.88,60.95 41.8,66.03 v37.99,66.03
ADC5  (via drill 0.33)
  Top 0.305: C23.2 8.94,64.76 R42.2 IC6.7 | IC4.14 59.42,55.55 59.42,50.63 57.04,48.25 45.45,48.25 39.1,41.9 37.83,41.9 36.88,40.95 34.34,40.95 23.86,51.43 v19.89,51.43
  Bottom 0.305: v19.89,51.43 16.56,54.76 16.56,56.98 12.75,60.79 IC6.7
ADC6  (via drill 0.33, 0.35)
  Top 0.305: C24.2 8.94,54.6 R46.2 IC6.8 | v17.83,49.52 v24.5,49.52 | v61.01,50.79 62.28,52.06 IC4.11
  Bottom 0.305: v24.5,49.52 25.13,50.16 31.48,50.16 32.12,50.79 41.8,50.79 42.28,51.27 42.91,51.27 43.39,50.79 v61.01,50.79 | v17.83,49.52 17.51,49.52 14.02,53.01 14.02,54.6 IC6.8
ADC7  (via drill 0.33)
  Top 0.305: IC6.14 R50.2 31.8,54.6 C25.2 | IC4.6 53.23,52.06 49.42,55.87 v43.55,55.87
  Bottom 0.305: R50.2 v43.55,55.87
CLKIN
  Bottom 0.305: R54.2 38.15,14.91 43.23,19.99 TEENSY_LC.14/A0
N$1
  Bottom 0.305: R27.1 15.29,102.38 1.8,88.89 CV2A.1
N$2
  Top 0.305: C9.1 40.69,97.78 R1.1 R2.2 | R3.2 R2.2 | R5.2 R4.2 | R5.2 IC5.2 | R5.2 R2.2
N$3
  Top 0.305: IC5.1 R17.1 R1.2 | C9.2 47.04,97.78 R1.2 | R1.2 R6.1
N$4  (via drill 0.33)
  Top 0.305: v43.23,72.7 43.23,86.19 38.15,91.27 R2.1
  Bottom 0.305: IC3.15 47.36,62.22 43.23,66.35 v43.23,72.7
N$5  (via drill 0.33)
  Top 0.305: IC3.2 39.26,62.22 v37.52,60.47 | v35.14,84.13 35.14,85.87 R5.1
  Bottom 0.305: v37.52,60.47 35.14,62.86 v35.14,84.13
N$6
  Top 0.305: IC3.10 53.55,49.52 54.82,50.79 57.04,50.79 57.84,51.58 57.84,55.08 57.04,55.87 54.82,55.87 53.07,57.62 53.07,81.43 49.42,85.08 45.45,85.08 39.42,91.11 39.42,92.7 R3.1
N$7  (via drill 0.33)
  Top 0.305: IC3.7 37.52,52.7 v37.52,59.2
  Bottom 0.305: v37.52,59.2 34.34,62.38 34.34,82.22 31.8,84.76 31.8,88.57 31.32,89.05 31.32,89.68 31.96,90.32 33.07,90.32 37.04,86.35 R4.1
N$8
  Top 0.305: C10.1 41.96,69.84 41.88,69.92 | R8.1 41.88,69.92 | 45.77,73.81 R9.2 R12.2 | R11.2 R12.2 | R12.2 IC5.6 | 45.77,73.81 41.88,69.92 | 45.77,73.81 R10.2
N$9
  Top 0.305: IC5.7 R18.1 R8.2 | C10.2 47.04,69.84 R8.2 | R8.2 R13.1
N$10
  Bottom 0.305: R9.1 38.15,77.14 36.88,78.41 36.88,81.59 37.83,82.54 40.37,82.54 45.45,77.46 49.42,77.46 61.65,65.24 61.65,64.12 IC4.15
N$11
  Bottom 0.305: IC4.2 52.6,62.22 50.22,64.6 50.22,66.98 38.47,78.73 R12.1
N$12  (via drill 0.33)
  Top 0.305: v44.18,66.98 41.96,66.98 38.15,70.79 R10.1
  Bottom 0.305: IC4.10 65.46,51.43 65.46,60.16 64.66,60.95 51.96,60.95 49.42,63.49 47.2,63.49 44.18,66.51 v44.18,66.98
N$13  (via drill 0.33)
  Top 0.305: IC4.7 56.88,49.52 58.63,51.27 v58.63,64.92
  Bottom 0.305: v58.63,64.92 48.63,74.92 44.5,74.92 R11.1
N$14
  Top 0.305: R6.2 63.87,96.51 68.63,91.75 OUT1.1
N$15
  Bottom 0.305: R13.2 63.87,71.11 68.63,75.87 OUT2.1
N$16
  Top 0.305: C11.2 59.74,74.92 R14.2 | R14.2 IC5.8 | R14.2 R16.1
N$17
  Top 0.305: C11.1 64.82,74.92 R14.1
  Bottom 0.305: R18.2 54.03,75.55 54.03,76.82 IC5.9 59.74,82.54 | R17.2 57.52,93.97 59.74,91.75 59.74,82.54 | 59.74,82.54 R14.1
N$18
  Top 0.305: R67.1 R15.2 57.2,91.43 | 57.2,91.43 C12.2 | 57.2,91.43 IC5.14
N$19
  Top 0.305: C12.1 64.82,92.7 65.38,92.14 | R15.1 65.38,92.14 | IC5.13 59.03,85.79 | 59.03,85.79 R16.2 | 59.03,85.79 65.38,92.14
N$20
  Top 0.305: TRIG1.1 R20.1
N$21
  Top 0.305: Q3.2 54.03,24.75 R20.2 R24.2
N$22  (via drill 0.33)
  Top 0.305: v8.31,94.13 1.48,94.13 CV1A.1
  Bottom 0.305: R22.1 27.04,104.13 25.77,102.86 17.04,102.86 v8.31,94.13
N$23
  Top 0.305: R26.1 45.77,26.66 | 45.77,26.66 R19.1 | 45.77,26.66 Q3.1
N$24
  Top 0.305: C16.1 31.8,100.32 31.72,100.4 | R21.1 31.72,100.4 | IC1.2 R23.2 27.83,96.51 | 27.83,96.51 31.72,100.4 | 27.83,96.51 R22.2
N$25
  Top 0.305: R59.1 66.09,19.04 RSTIN.1
N$26  (via drill 0.33)
  Top 0.305: v2.91,91.27 2.91,87.94 CV2B.1
  Bottom 0.305: R28.1 12.75,101.11 v2.91,91.27
N$27  (via drill 0.33)
  Top 0.305: R23.1 16.88,104.13 12.91,100.16 v10.37,100.16
  Bottom 0.305: v10.37,100.16 8.46,100.16 2.59,94.29 2.59,92.7 CV1B.1
N$28
  Top 0.305: R67.2 66.09,86.35 OUTSUM.1
N$29
  Top 0.305: IC1.6 R27.2 R28.2 8.94,100.32 | C17.1 7.67,99.05 8.94,100.32 | R25.1 8.94,100.32
N$30
  Top 0.305: C21.1 31.8,78.73 R34.1 R36.2 | IC1.13 R36.2 | R36.2 R35.2
N$31  (via drill 0.33)
  Top 0.305: v26.72,90.32 24.18,92.86 24.18,95.08 21.48,97.78 19.26,97.78 16.56,95.08 16.56,92.86 11.32,87.62 8.62,87.62 2.59,81.59 2.59,80 CV4A.1
  Bottom 0.305: R35.1 27.99,82.22 26.72,83.49 v26.72,90.32
N$32  (via drill 0.33)
  Top 0.305: R36.1 25.45,81.11 21.64,84.92 v21.64,88.57 | CV4B.1 v8.94,83.81
  Bottom 0.305: v21.64,88.57 21.32,88.89 11.16,88.89 8.94,86.67 v8.94,83.81
N$33
  Top 0.305: R33.1 66.09,29.2 TRIG2.1
N$34
  Bottom 0.305: R32.1 14.34,76.19 13.07,74.92 7.67,74.92 CV3B.1
N$35
  Bottom 0.305: R31.1 8.46,76.19 1.32,83.33 CV3A.1
N$36
  Top 0.305: C20.1 8.94,80 9.02,79.92 | R30.1 9.02,79.92 | 12.91,83.81 R32.2 IC1.9 | 12.91,83.81 9.02,79.92 | 12.91,83.81 R31.2
N$37
  Top 0.305: 12_MISO.1 TEENSY_LC.12
N$38
  Top 0.305: C22.1 31.8,69.84 31.72,69.92 | R38.1 31.72,69.92 | IC6.2 R40.2 27.83,66.03 | 27.83,66.03 31.72,69.92 | 27.83,66.03 R39.2
N$39
  Top 0.305: 0_RX.1 TEENSY_LC.0
N$40  (via drill 0.33)
  Top 0.305: R40.1 25.45,68.41 21.64,64.6 v21.64,61.27 | v13.86,60.95 9.89,60.95 2.59,68.25 2.59,69.84 CV5B.1
  Bottom 0.305: v21.64,61.27 21.32,60.95 v13.86,60.95
N$41  (via drill 0.33)
  Top 0.305: R39.1 27.99,74.6 26.72,75.87 26.72,80.95 24.18,83.49 24.18,87.46 v21.96,89.68 | v6.24,79.68 6.24,78.57 CV5A.1
  Bottom 0.305: v21.96,89.68 10.69,89.68 6.08,85.08 6.08,79.84 v6.24,79.68
N$42
  Top 0.305: 1_TX.1 TEENSY_LC.1
N$43
  Top 0.305: C23.1 8.94,69.84 9.02,69.92 | R42.1 9.02,69.92 | IC6.6 R44.2 12.91,66.03 | 12.91,66.03 9.02,69.92 | 12.91,66.03 R45.2
N$44  (via drill 0.33)
  Top 0.305: R44.1 14.34,73.65 13.07,72.38 v5.13,72.38
  Bottom 0.305: CV6A.1 v5.13,72.38
N$45
  Bottom 0.305: R45.1 8.94,73.65 CV6B.1
N$46
  Top 0.305: C25.1 31.8,48.25 R50.1 R52.2 | IC6.13 R52.2 | R52.2 R51.2
N$47
  Top 0.305: Q4.2 54.03,29.83 R33.2 R37.2
N$48  (via drill 0.33)
  Top 0.305: R51.1 27.04,45.71 20.69,39.36 v18.15,39.36
  Bottom 0.305: CV8A.1 1.32,58.25 8.79,50.78 8.79,46.82 16.1,39.51 18,39.51 v18.15,39.36
N$49  (via drill 0.35)
  Top 0.305: R52.1 19.1,45.71 v17.83,46.98 | v10.21,53.97 9.28,53.97 8.79,53.48 7.21,53.48 4.82,55.87 CV8B.1
  Bottom 0.305: v17.83,46.98 12.62,52.19 11.99,52.19 v10.21,53.97
N$50
  Bottom 0.305: R48.1 12.75,47.93 2.59,58.09 2.59,59.68 CV7B.1
N$51
  Bottom 0.305: R47.1 15.29,47.3 8.94,53.65 8.94,55.87 CV7A.1
N$52
  Top 0.305: C24.1 8.94,49.52 9.02,49.44 | R46.1 9.02,49.44 | 12.91,53.33 R47.2 IC6.9 | 12.91,53.33 9.02,49.44 | 12.91,53.33 R48.2
N$53
  Top 0.305: R41.1 45.77,31.74 | 45.77,31.74 R29.1 | 45.77,31.74 Q4.1
N$54
  Top 0.305: R55.1 63.55,13.96 CLKIN.1
N$55
  Top 0.305: Q1.2 54.03,14.6 R55.2 R56.2
N$56
  Top 0.305: R54.1 R57.1
  Bottom 0.305: Q1.1 48.31,16.5 R54.1
N$58
  Top 0.305: Q2.2 54.03,19.67 R59.2 R60.2
N$59
  Top 0.305: R61.1 R58.1
  Bottom 0.305: Q2.1 48.31,21.58 R61.1
N$60
  Top 0.305: R49.1 63.55,34.28 TRIG3.1
N$61
  Top 0.305: Q5.2 54.03,34.91 R49.2 R53.2
N$62
  Top 0.305: 10_CS.1 TEENSY_LC.10
N$63
  Top 0.305: 11_MOSI.1 TEENSY_LC.11
N$64
  Top 0.305: TEENSY_LC.13 45.77,20.63 48.31,18.09 13_SCK.1
N$65
  Top 0.305: R62.1 45.77,36.82 | 45.77,36.82 R43.1 | 45.77,36.82 Q5.1
N$67
  Top 0.305: R64.1 62.28,38.41 68.63,32.06 TRIG4.1
N$68
  Top 0.305: Q6.2 54.03,40 R64.2 R65.2
N$69
  Top 0.305: R66.1 45.77,41.9 | 45.77,41.9 R63.1 | 45.77,41.9 Q6.1
PE
  Top 0.305: IC7.1 28.14,36.97 28.45,36.97 29.9,38.41 IC8.2
  Bottom 0.305: IC4.5 50.6,54.6 49.48,53.48 47.14,53.48 46.02,54.6 IC3.5 | IC6.12 22.91,50.79 C8.2 | IC6.12 22.66,55.87 20.83,57.7 19.91,57.7 18.08,55.87 IC6.10 | IC6.12 IC6.3 | IC6.3 22.66,63.49 20.83,61.66 19.91,61.66 18.08,63.49 IC6.5 | IC6.3 21.49,64.91 21.49,66.49 20.37,67.61 C7.1 C5.2 20.37,82.23 21.49,83.35 21.49,84.93 IC1.12 | IC1.12 22.66,86.35 20.83,88.18 19.91,88.18 18.08,86.35 IC1.10 | IC1.12 IC1.3 | IC1.3 22.66,93.97 20.83,92.14 19.91,92.14 18.08,93.97 IC1.5 | IC1.3 21.49,95.39 21.49,96.97 20.37,98.09 C4.1 | IC1.3 23.16,93.97 24.99,92.14 32.36,92.14 37.03,87.47 46.23,87.47 47.35,86.35 IC5.3 | IC5.3 IC5.12 54.1,84.52 54.1,83.1 IC5.10 | IC5.3 48.31,86.1 50.14,84.27 50.14,83.35 48.31,81.52 IC5.5
  pour Bottom: 69.9,-0.01 0.05,-0.01 0.05,105.4 69.9,105.4
RSTIN
  Bottom 0.305: R58.2 38.15,17.45 40.69,19.99 TEENSY_LC.15/A1
SW1  (via drill 0.33)
  Top 0.305: IC3.1 37.36,61.43 37.2,61.43 36.56,60.79 v36.56,41.9 | LED1.1 TEENSY_LC.2
  Bottom 0.305: v36.56,41.9 36.56,35.71 24.18,23.33 24.18,11.42 TEENSY_LC.2
SW2  (via drill 0.33)
  Top 0.305: v51.33,64.76 50.69,64.76 49.42,66.03 39.58,66.03 35.45,61.9 v35.45,41.9
  Bottom 0.305: v51.33,64.76 IC4.1 | v35.45,41.9 35.45,37.14 21.64,23.33 21.64,10.63 19.1,8.09 19.1,5.07 19.74,4.44 | LED2.1 19.74,4.44 | 19.74,4.44 TEENSY_LC.3
SW3  (via drill 0.33)
  Top 0.305: IC3.16 42.6,59.05 v42.6,50.31 | TEENSY_LC.4 LED3.1
  Bottom 0.305: v42.6,50.31 42.6,26.5 39.42,23.33 39.42,21.9 25.45,7.93 TEENSY_LC.4
SW4
  Top 0.305: TEENSY_LC.5 LED4.1
  Bottom 0.305: IC4.16 66.25,62.06 66.25,16.34 56.25,6.34 32.59,6.34 31.8,7.13 31.8,8.09 31.01,8.88 29.26,8.88 TEENSY_LC.5
SW5  (via drill 0.33)
  Top 0.305: IC3.9 47.99,46.98 44.5,43.49 v44.5,5.39
  Bottom 0.305: v44.5,5.39 32.44,5.39 30.53,7.29 TEENSY_LC.6 LED5.1
SW6  (via drill 0.35)
  Top 0.305: TEENSY_LC.7 LED6.1 | v51.49,45.39 61.96,45.39 IC4.9
  Bottom 0.305: v51.49,45.39 47.04,40.95 47.04,21.9 39.42,14.28 39.42,11.1 37.2,8.88 34.34,8.88 TEENSY_LC.7
SW7  (via drill 0.33)
  Top 0.305: v40.69,25.87 40.69,25.55 41.96,24.28 41.96,13.64 35.93,7.61 TEENSY_LC.8 LED7.1
  Bottom 0.305: v40.69,25.87 IC3.8
SW8
  Top 0.305: TEENSY_LC.9 LED8.1
  Bottom 0.305: TEENSY_LC.9 39.42,8.88 46.72,8.88 53.39,15.55 53.39,44.44 IC4.8
TRIG1
  Top 0.305: TEENSY_LC.16/A2 R19.2
TRIG2
  Bottom 0.305: R29.2 38.15,29.52 36.72,28.09 36.72,23.96 TEENSY_LC.17/A3
TRIG3
  Bottom 0.305: R43.2 38.15,34.6 29.26,25.71 29.26,22.37 30.05,21.58 31.8,21.58 TEENSY_LC.18/A4
TRIG4  (via drill 0.33)
  Top 0.305: R63.2 38.15,39.68 36.09,37.61 v36.09,28.88
  Bottom 0.305: v36.09,28.88 36.09,28.41 TEENSY_LC.19/A5

### Text on the board
tNames: PGTN029 SEQ_SWITCH | CV1 | CV2 | OUT1 | SUM | CV3 | OUT2 | CV4 | CV5 | CV6 | CV7 | Rob Ellis 2021 | CV8 | TRG4 | TRG3 | TRG2 | TRG1 | RST | -5V | CLK | GND | 5V | 3.3V | RX | TX | LED1 | LED2 | LED3 | LED4 | LED5 | LED6 | LED7 | LED8 | CS | MOSI | MISO | SCK